# Altium project SAMSUNG_Note3_Monitor.PrjPcb
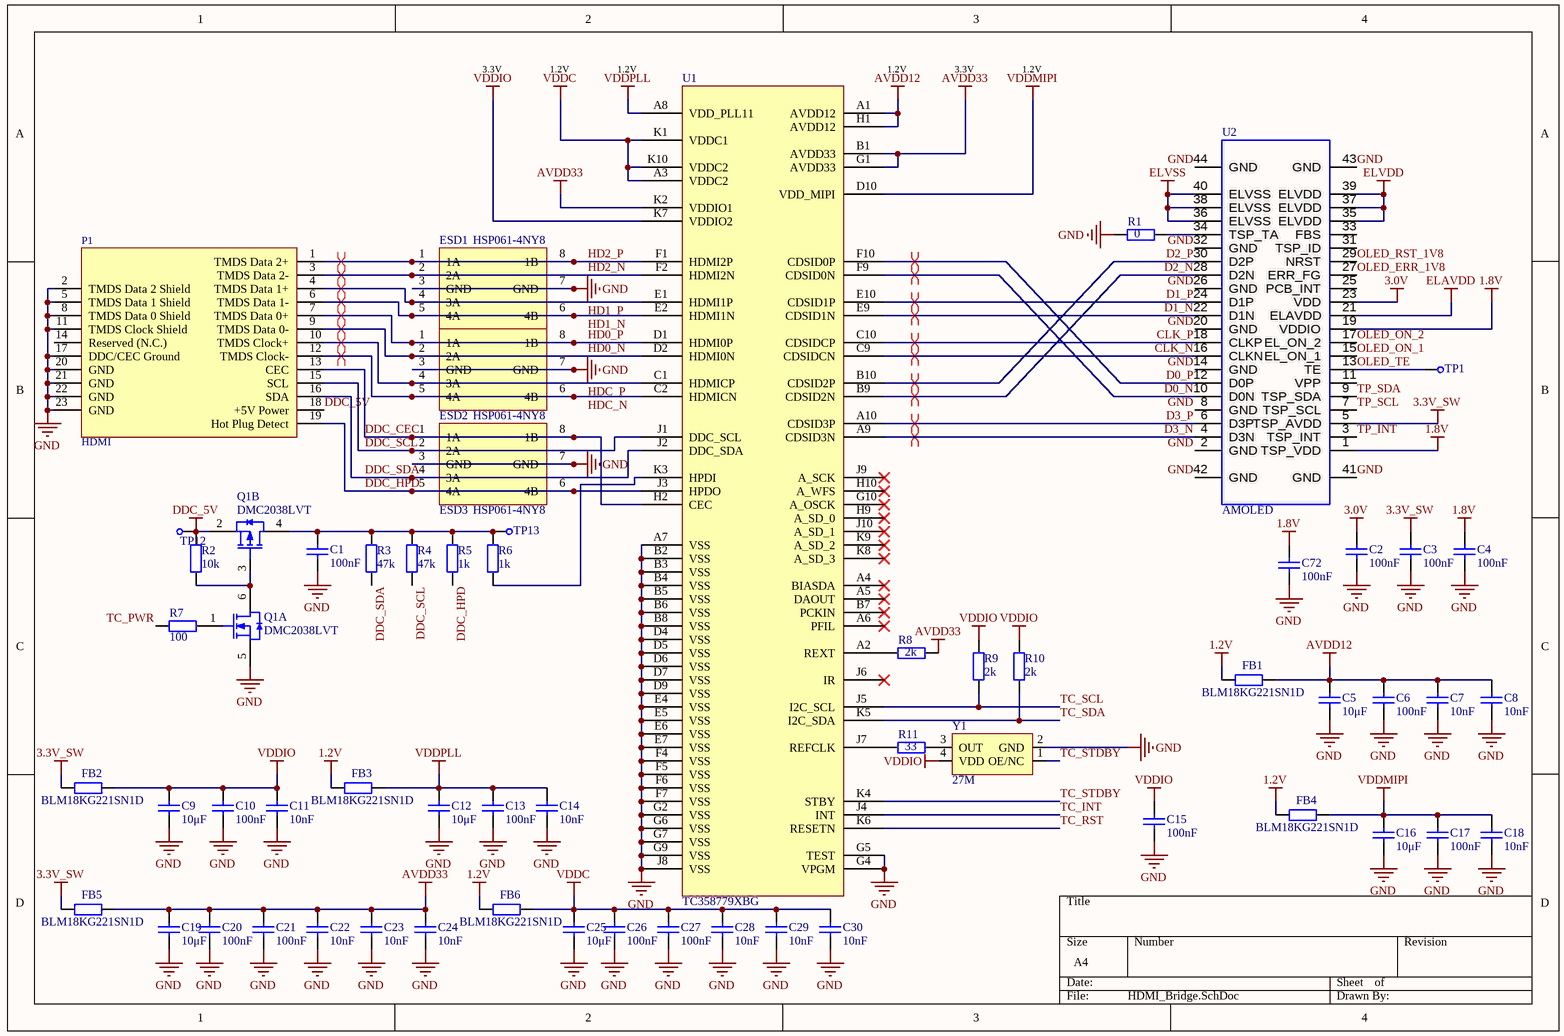
[diagram p0: HDMI_Bridge.SchDoc]
3 sheets, 163 parts. Net scope: global (net labels, ports and power ports of the same name join across sheets).
Board file: SAMSUNG_Note3_Monitor.PcbDoc
Sheets:
  HDMI_Bridge.SchDoc
  STM32.SchDoc
  Power.SchDoc

## Sheet HDMI_Bridge.SchDoc
size A4; SheetNumber: 1; SheetTotal: 3

### Parts
C1  value 100nF  [0402C]  (hidden comment: Cap)
C2  value 100nF  [0402C]  (hidden comment: Cap)
C3  value 100nF  [0402C]  (hidden comment: Cap)
C4  value 100nF  [0402C]  (hidden comment: Cap)
C5  value 10μF  [0603C]  (hidden comment: Cap)
C6  value 100nF  [0402C]  (hidden comment: Cap)
C7  value 10nF  [0402C]  (hidden comment: Cap)
C8  value 10nF  [0402C]  (hidden comment: Cap)
C9  value 10μF  [0603C]  (hidden comment: Cap)
C10  value 100nF  [0402C]  (hidden comment: Cap)
C11  value 10nF  [0402C]  (hidden comment: Cap)
C12  value 10μF  [0603C]  (hidden comment: Cap)
C13  value 100nF  [0402C]  (hidden comment: Cap)
C14  value 10nF  [0402C]  (hidden comment: Cap)
C15  value 100nF  [0402C]  (hidden comment: Cap)
C16  value 10μF  [0603C]  (hidden comment: Cap)
C17  value 100nF  [0402C]  (hidden comment: Cap)
C18  value 10nF  [0402C]  (hidden comment: Cap)
C19  value 10μF  [0603C]  (hidden comment: Cap)
C20  value 100nF  [0402C]  (hidden comment: Cap)
C21  value 100nF  [0402C]  (hidden comment: Cap)
C22  value 10nF  [0402C]  (hidden comment: Cap)
C23  value 10nF  [0402C]  (hidden comment: Cap)
C24  value 10nF  [0402C]  (hidden comment: Cap)
C25  value 10μF  [0603C]  (hidden comment: Cap)
C26  value 100nF  [0402C]  (hidden comment: Cap)
C27  value 100nF  [0402C]  (hidden comment: Cap)
C28  value 10nF  [0402C]  (hidden comment: Cap)
C29  value 10nF  [0402C]  (hidden comment: Cap)
C30  value 10nF  [0402C]  (hidden comment: Cap)
C72  value 100nF  [0402C]  (hidden comment: Cap)
ESD1  HSP061-4NY8  [HSP061-4NY8]
ESD2  HSP061-4NY8  [HSP061-4NY8]
ESD3  HSP061-4NY8  [HSP061-4NY8]
FB1  value BLM18KG221SN1D  [0603R]  (hidden comment: Resistor)
FB2  value BLM18KG221SN1D  [0603R]  (hidden comment: Resistor)
FB3  value BLM18KG221SN1D  [0603R]  (hidden comment: Resistor)
FB4  value BLM18KG221SN1D  [0603R]  (hidden comment: Resistor)
FB5  value BLM18KG221SN1D  [0603R]  (hidden comment: Resistor)
FB6  value BLM18KG221SN1D  [0603R]  (hidden comment: Resistor)
P1  HDMI  [HDMI-SMD_HDMI-001S]
Q1  DMC2038LVT  [SOT-23-6]  (parts A,B of 2)
R1  value 0  [0402R]  (hidden comment: Resistor)
R2  value 10k  [0402R]  (hidden comment: Resistor)
R3  value 47k  [0402R]  (hidden comment: Resistor)
R4  value 47k  [0402R]  (hidden comment: Resistor)
R5  value 1k  [0402R]  (hidden comment: Resistor)
R6  value 1k  [0402R]  (hidden comment: Resistor)
R7  value 100  [0402R]  (hidden comment: Resistor)
R8  value 2k  [0402R]  (hidden comment: Resistor)
R9  value 2k  [0402R]  (hidden comment: Resistor)
R10  value 2k  [0402R]  (hidden comment: Resistor)
R11  value 33  [0402R]  (hidden comment: Resistor)
TP1  CHECK  [CHECK-B]  (value not drawn)
TP12  CHECK  [CHECK-B]  (value not drawn)
TP13  CHECK  [CHECK-B]  (value not drawn)
U1  TC358779XBG  [BGA-80_L7.0-W7.0-R10-C10-P0.65-TL]
U2  AMOLED  [BTB_AXE440124]
Y1  value 27M  [XTAL-3225-4P]  (hidden comment: XATLS)

### Nets
1.2V: FB1.1 FB3.1 FB4.1 FB6.1
1.8V: C4.2 C72.2 U2.1(TSP_VDD) U2.19(VDDIO)
3.0V: C2.2 U2.23(VDD)
3.3V_SW: C3.2 FB2.1 FB5.1 U2.5(TSP_AVDD)
AVDD12: C5.2 C6.2 C7.2 C8.2 FB1.2 U1.A1(AVDD12) U1.H1(AVDD12)
AVDD33: C19.2 C20.2 C21.2 C22.2 C23.2 C24.2 FB5.2 R8.1 U1.B1(AVDD33) U1.G1(AVDD33) U1.K2(VDDIO1)
DDC_5V: P1.18(+5V_Power) Q1.2(S) R2.1 TP12.1
ELAVDD: U2.21(ELAVDD)
ELVDD: U2.35(ELVDD) U2.37(ELVDD) U2.39(ELVDD)
ELVSS: U2.36(ELVSS) U2.38(ELVSS) U2.40(ELVSS)
GND: C1.1 C2.1 C3.1 C4.1 C5.1 C6.1 C7.1 C8.1 C9.1 C10.1 C11.1 C12.1 C13.1 C14.1 C15.1 C16.1 C17.1 C18.1 C19.1 C20.1 C21.1 C22.1 C23.1 C24.1 C25.1 C26.1 C27.1 C28.1 C29.1 C30.1 C72.1 ESD1.3(GND) ESD1.7(GND) ESD2.3(GND) ESD2.7(GND) ESD3.3(GND) ESD3.7(GND) P1.2(TMDS_Data_2_Shield) P1.5(TMDS_Data_1_Shield) P1.8(TMDS_Data_0_Shield) P1.11(TMDS_Clock_Shield) P1.17(DDC/CEC_Ground) P1.20(GND) P1.21(GND) P1.22(GND) P1.23(GND) Q1.5(S) R1.2 U1.A7(VSS) U1.B2(VSS) U1.B3(VSS) U1.B4(VSS) U1.B5(VSS) U1.B6(VSS) U1.B8(VSS) U1.D4(VSS) U1.D5(VSS) U1.D6(VSS) U1.D7(VSS) U1.D9(VSS) U1.E4(VSS) U1.E5(VSS) U1.E6(VSS) U1.E7(VSS) U1.F4(VSS) U1.F5(VSS) U1.F6(VSS) U1.F7(VSS) U1.G2(VSS) U1.G4(VPGM) U1.G5(TEST) U1.G6(VSS) U1.G7(VSS) U1.G9(VSS) U1.J8(VSS) U2.2(GND) U2.8(GND) U2.14(GND) U2.20(GND) U2.26(GND) U2.32(GND) U2.41(GND) U2.42(GND) U2.43(GND) U2.44(GND) Y1.2(GND)
VDDC: C25.2 C26.2 C27.2 C28.2 C29.2 C30.2 FB6.2 U1.A3(VDDC2) U1.K1(VDDC1) U1.K10(VDDC2)
VDDIO: C9.2 C10.2 C11.2 C15.2 FB2.2 R9.1 R10.1 U1.K7(VDDIO2) Y1.4(VDD)
VDDMIPI: C16.2 C17.2 C18.2 FB4.2 U1.D10(VDD_MIPI)
VDDPLL: C12.2 C13.2 C14.2 FB3.2 U1.A8(VDD_PLL11)
CLK_N: U1.C9(CDSIDCN) U2.16(CLKN)
CLK_P: U1.C10(CDSIDCP) U2.18(CLKP)
D0_N: U1.F9(CDSID0N) U2.10(D0N)
D0_P: U1.F10(CDSID0P) U2.12(D0P)
D1_N: U1.E9(CDSID1N) U2.22(D1N)
D1_P: U1.E10(CDSID1P) U2.24(D1P)
D2_N: U1.B9(CDSID2N) U2.28(D2N)
D2_P: U1.B10(CDSID2P) U2.30(D2P)
D3_N: U1.A9(CDSID3N) U2.4(D3N)
D3_P: U1.A10(CDSID3P) U2.6(D3P)
DDC_CEC: ESD3.1(1A) ESD3.8(1B) P1.13(CEC) U1.H2(CEC)
DDC_HPD: ESD3.5(4A) ESD3.6(4B) P1.19(Hot_Plug_Detect) R5.2 U1.J3(HPDO)
DDC_SCL: ESD3.2(2A) P1.15(SCL) R4.2 U1.J1(DDC_SCL)
DDC_SDA: ESD3.4(3A) P1.16(SDA) R3.2 U1.J2(DDC_SDA)
HD0_N: ESD2.2(2A) P1.9(TMDS_Data_0-) U1.D2(HDMI0N)
HD0_P: ESD2.1(1A) ESD2.8(1B) P1.7(TMDS_Data_0+) U1.D1(HDMI0P)
HD1_N: ESD1.5(4A) ESD1.6(4B) P1.6(TMDS_Data_1-) U1.E2(HDMI1N)
HD1_P: ESD1.4(3A) P1.4(TMDS_Data_1+) U1.E1(HDMI1P)
HD2_N: ESD1.2(2A) P1.3(TMDS_Data_2-) U1.F2(HDMI2N)
HD2_P: ESD1.1(1A) ESD1.8(1B) P1.1(TMDS_Data_2+) U1.F1(HDMI2P)
HDC_N: ESD2.5(4A) ESD2.6(4B) P1.12(TMDS_Clock-) U1.C2(HDMICN)
HDC_P: ESD2.4(3A) P1.10(TMDS_Clock+) U1.C1(HDMICP)
OLED_ERR_1V8: U2.27(ERR_FG)
OLED_ON_1: U2.15(EL_ON_1)
OLED_ON_2: U2.17(EL_ON_2)
OLED_RST_1V8: U2.29(NRST)
OLED_TE: TP1.1 U2.13(TE)
TC_INT: U1.J4(INT)
TC_PWR: R7.1
TC_RST: U1.K6(RESETN)
TC_SCL: R9.2 U1.J5(I2C_SCL)
TC_SDA: R10.2 U1.K5(I2C_SDA)
TC_STDBY: U1.K4(STBY) Y1.1(OE/NC)
TP_INT: U2.3(TSP_INT)
TP_SCL: U2.7(TSP_SCL)
TP_SDA: U2.9(TSP_SDA)
NetC1_2: C1.2 Q1.4(D) R3.1 R4.1 R5.1 R6.1 TP13.1
NetQ1_1: Q1.1(G) R7.2
NetQ1_3: Q1.3(G) Q1.6(D) R2.2
NetR1_1: R1.1 U2.34(TSP_TA)
NetR6_2: R6.2 U1.K3(HPDI)
NetR8_2: R8.2 U1.A2(REXT)
NetR11_1: R11.1 Y1.3(OUT)
NetR11_2: R11.2 U1.J7(REFCLK)

Not connected (* = marked no-connect by the designer): P1 14(Reserved_(N.C.)); U1 A4(BIASDA)* A5(DAOUT)* A6(PFIL)* B7(PCKIN)* G10(A_OSCK)* H9(A_SD_0)* H10(A_WFS)* J6(IR)* J9(A_SCK)* J10(A_SD_1)* K8(A_SD_3)* K9(A_SD_2)*; U2 11(VPP) 25(PCB_INT) 31(TSP_ID) 33(FBS)

### Layout directives
differential pair: CLK_N, CLK_P, D0_N, D0_P, D1_N, D1_P, D2_N, D2_P, D3_N, D3_P, HD0_N, HD0_P, HD1_N, HD1_P, HD2_N, HD2_P, HDC_N, HDC_P

### Notes on the sheet
- 3.3V
- 1.2V

### Library data of the parts
C1-C30 C72 = Cap: 无极性电容; Published: 8-Jun-2000; LatestRevisionDate: 17-Jul-2002; LatestRevisionNote: Re-released for DXP Platform.; PackageReference: RAD-0.3; Publisher: Altium Limited
ESD1-ESD3 = HSP061-4NY8: IC, 4-LINE ESD PROTECTION ARRAY, HIGH SPEED; Manufacturer: STMICROELECTRONICS; Part Number: HSP061-4NY8; Verified Pinout: *
FB1-FB6 R1-R11 = Resistor: 电阻; Published: 8-Jun-2000; LatestRevisionDate: 17-Jul-2002; LatestRevisionNote: Re-released for DXP Platform.; PackageReference: AXIAL-0.4; Publisher: Altium Limited
P1 = HDMI-Slot: HDMI Slot; BOM_Manufacturer: XUNPU(讯普); BOM_Manufacturer Part: HDMI-001S; Contributor: LCSC; BOM_Supplier: LCSC; BOM_Supplier Part: C720616; BOM_JLCPCB Part Class: Extended Part; spicePre: U; spiceSymbolName: HDMI-001S
Q1 = DMC2038LVT: Dual P + N MOS
TP1 TP12 TP13 = CHECK: 测试点
U1 = TC358779XBG: IC, HDMI RX TO MIPI DSI TX BRIDGE; Manufacturer: TOSHIBA; Part Number: TC358779XBG; Verified Pinout: *
U2 = OLED_AMS568: SAMSUNG AMOLED, CONNECTOR AXE440124, 40-PIN HEADER, 0.4MM PITCH; Manufacturer: PANASONIC; Part Number: AXE440124; Verified Pinout: *
Y1 = XATL-OSC: 贴片有源晶振

## Sheet STM32.SchDoc
size A4; SheetNumber: 2; SheetTotal: 3
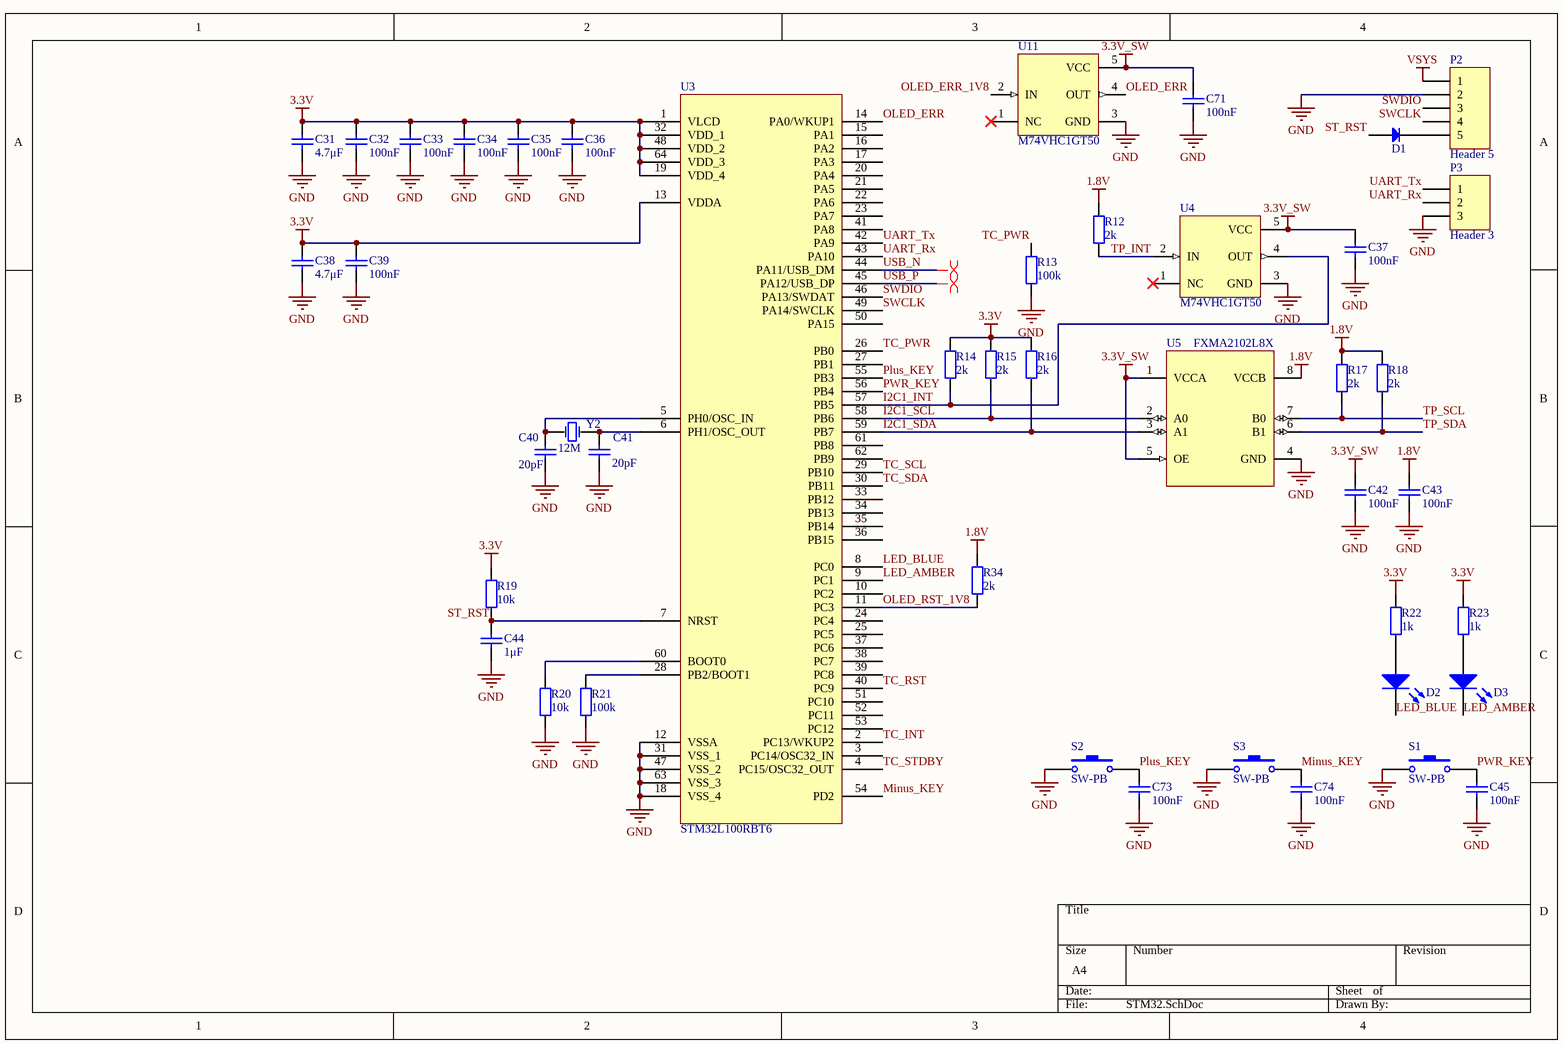
[diagram p1: STM32.SchDoc]

### Parts
C31  value 4.7μF  [0402C]  (hidden comment: Cap)
C32  value 100nF  [0402C]  (hidden comment: Cap)
C33  value 100nF  [0402C]  (hidden comment: Cap)
C34  value 100nF  [0402C]  (hidden comment: Cap)
C35  value 100nF  [0402C]  (hidden comment: Cap)
C36  value 100nF  [0402C]  (hidden comment: Cap)
C37  value 100nF  [0402C]  (hidden comment: Cap)
C38  value 4.7μF  [0402C]  (hidden comment: Cap)
C39  value 100nF  [0402C]  (hidden comment: Cap)
C40  value 20pF  [0402C]  (hidden comment: Cap)
C41  value 20pF  [0402C]  (hidden comment: Cap)
C42  value 100nF  [0402C]  (hidden comment: Cap)
C43  value 100nF  [0402C]  (hidden comment: Cap)
C44  value 1μF  [0402C]  (hidden comment: Cap)
C45  value 100nF  [0402C]  (hidden comment: Cap)
C71  value 100nF  [0402C]  (hidden comment: Cap)
C73  value 100nF  [0402C]  (hidden comment: Cap)
C74  value 100nF  [0402C]  (hidden comment: Cap)
D1  Diode  [SOD-323]  (value not drawn)
D2  LED0  [0603LED]  (value not drawn)
D3  LED0  [0603LED]  (value not drawn)
P2  Header 5  [HDR1X5]
P3  Header 3  [HDR1X3]
R12  value 2k  [0402R]  (hidden comment: Resistor)
R13  value 100k  [0402R]  (hidden comment: Resistor)
R14  value 2k  [0402R]  (hidden comment: Resistor)
R15  value 2k  [0402R]  (hidden comment: Resistor)
R16  value 2k  [0402R]  (hidden comment: Resistor)
R17  value 2k  [0402R]  (hidden comment: Resistor)
R18  value 2k  [0402R]  (hidden comment: Resistor)
R19  value 10k  [0402R]  (hidden comment: Resistor)
R20  value 10k  [0402R]  (hidden comment: Resistor)
R21  value 100k  [0402R]  (hidden comment: Resistor)
R22  value 1k  [0402R]  (hidden comment: Resistor)
R23  value 1k  [0402R]  (hidden comment: Resistor)
R34  value 2k  [0402R]  (hidden comment: Resistor)
S1  SW-PB  [SW-TS-TL3330E]
S2  SW-PB  [SW-TS-TL3330E]
S3  SW-PB  [SW-TS-TL3330E]
U3  STM32L100RBT6  [LQFP-64]
U4  M74VHC1GT50  [SC-70(SC-70-5)]
U5  FXMA2102L8X  [QFN-8_L1.6_W1.6]
U11  M74VHC1GT50  [SC-70(SC-70-5)]
Y2  value 12M  [XTAL_HC-49USX]  (hidden comment: XTAL)

### Nets
1.8V: C43.2 R12.1 R17.1 R18.1 R34.1 U5.8(VCCB)
3.3V: C31.2 C32.2 C33.2 C34.2 C35.2 C36.2 C38.2 C39.2 R14.1 R15.1 R16.1 R19.1 R22.1 R23.1 U3.1(VLCD) U3.13(VDDA) U3.19(VDD_4) U3.32(VDD_1) U3.48(VDD_2) U3.64(VDD_3)
3.3V_SW: C37.2 C42.2 C71.2 U4.5(VCC) U5.1(VCCA) U5.5(OE) U11.5(VCC)
GND: C31.1 C32.1 C33.1 C34.1 C35.1 C36.1 C37.1 C38.1 C39.1 C40.1 C41.1 C42.1 C43.1 C44.1 C45.1 C71.1 C73.1 C74.1 P2.2 P3.3 R13.2 R20.2 R21.2 S1.1 S2.1 S3.1 U3.12(VSSA) U3.18(VSS_4) U3.31(VSS_1) U3.47(VSS_2) U3.63(VSS_3) U4.3(GND) U5.4(GND) U11.3(GND)
VSYS: P2.1
I2C1_INT: R14.2 U3.57(PB5) U4.4(OUT)
I2C1_SCL: R15.2 U3.58(PB6) U5.2(A0)
I2C1_SDA: R16.2 U3.59(PB7) U5.3(A1)
LED_AMBER: D3.2(K) U3.9(PC1)
LED_BLUE: D2.2(K) U3.8(PC0)
Minus_KEY: C74.2 S3.2 U3.54(PD2)
OLED_ERR: U3.14(PA0/WKUP1) U11.4(OUT)
OLED_ERR_1V8: U11.2(IN)
OLED_RST_1V8: R34.2 U3.11(PC3)
Plus_KEY: C73.2 S2.2 U3.55(PB3)
PWR_KEY: C45.2 S1.2 U3.56(PB4)
ST_RST: C44.2 D1.1(A) R19.2 U3.7(NRST)
SWCLK: P2.4 U3.49(PA14/SWCLK)
SWDIO: P2.3 U3.46(PA13/SWDAT)
TC_INT: U3.2(PC13/WKUP2)
TC_PWR: R13.1 U3.26(PB0)
TC_RST: U3.40(PC9)
TC_SCL: U3.29(PB10)
TC_SDA: U3.30(PB11)
TC_STDBY: U3.4(PC15/OSC32_OUT)
TP_INT: R12.2 U4.2(IN)
TP_SCL: R17.2 U5.7(B0)
TP_SDA: R18.2 U5.6(B1)
UART_Rx: P3.2 U3.43(PA10)
UART_Tx: P3.1 U3.42(PA9)
USB_N: U3.44(PA11/USB_DM)
USB_P: U3.45(PA12/USB_DP)
NetC40_2: C40.2 U3.5(PH0/OSC_IN) Y2.2(OSC2)
NetC41_2: C41.2 U3.6(PH1/OSC_OUT) Y2.1(OSC1)
NetD1_2: D1.2(K) P2.5
NetD2_1: D2.1(A) R22.2
NetD3_1: D3.1(A) R23.2
NetR20_1: R20.1 U3.60(BOOT0)
NetR21_1: R21.1 U3.28(PB2/BOOT1)

Not connected (* = marked no-connect by the designer): U3 3(PC14/OSC32_IN) 10(PC2) 15(PA1) 16(PA2) 17(PA3) 20(PA4) 21(PA5) 22(PA6) 23(PA7) 24(PC4) 25(PC5) 27(PB1) 33(PB12) 34(PB13) 35(PB14) 36(PB15) 37(PC6) 38(PC7) 39(PC8) 41(PA8) 50(PA15) 51(PC10) 52(PC11) 53(PC12) 61(PB8) 62(PB9); U4 1(NC)*; U11 1(NC)*

### Layout directives
differential pair: USB_N, USB_P

### Library data of the parts
C31-C45 C71 C73 C74 = Cap: 无极性电容; Published: 8-Jun-2000; LatestRevisionDate: 17-Jul-2002; LatestRevisionNote: Re-released for DXP Platform.; PackageReference: RAD-0.3; Publisher: Altium Limited
D1 = Diode: 二极管; Type: 1N4001; Published: 8-Jun-2000; LatestRevisionDate: 17-Jul-2002; LatestRevisionNote: Re-released for DXP Platform.; PackageDocument: Sep-1996; PackageReference: SMC; Publisher: Altium Limited; Code_JEDEC: DO-214-AB
D2 D3 = LED0: 发光二极管; Published: 8-Jun-2000; LatestRevisionDate: 08-Jul-2005; LatestRevisionNote: Mech Layer 1 removed.; PackageReference: LED-0; Publisher: Altium Limited
P2 = Header 5: Header, 5-Pin; LatestRevisionDate: 17-Jul-2002; LatestRevisionNote: Re-released for DXP Platform.; Publisher: Altium Limited
P3 = Header 3: Header, 3-Pin; LatestRevisionDate: 17-Jul-2002; LatestRevisionNote: Re-released for DXP Platform.; Publisher: Altium Limited
R12-R23 R34 = Resistor: 电阻; Published: 8-Jun-2000; LatestRevisionDate: 17-Jul-2002; LatestRevisionNote: Re-released for DXP Platform.; PackageReference: AXIAL-0.4; Publisher: Altium Limited
S1-S3 = SW-PB: 微动开关; Published: 24-Mar-1999; LatestRevisionDate: 17-Jul-2002; LatestRevisionNote: Re-released for DXP Platform.; PackageReference: SPST-2; Publisher: Altium Limited
U3 = STM32L100RBT6: IC, STM32L MICROCONTROLLER, ARM CORTEX M3; Manufacturer: ST MICROELECTRONICS; Part Number: STM32L100RBT6; Verified Pinout: *
U4 U11 = M74VHC1GT50DFT2G: IC, NON-INVERTING BUFFER, CMOS LOGIC LEVEL SHIFTER; Manufacturer: ON SEMICONDUCTOR; Part Number: M74VHC1GT50DFT2G; Pinout verified: *
U5 = FXMA2102L8X: IC, I2C TRANSLATOR, BUFFER AND REPEATER; Manufacturer: FAIRCHILD SEMICONDUCTOR; Part Number: FXMA2102L8X; Verified Pinout: *
Y2 = XTAL-2P: 晶振; Published: 8-Jun-2000; LatestRevisionDate: 17-Jul-2002; LatestRevisionNote: Re-released for DXP Platform.; PackageReference: R38; Publisher: Altium Limited

## Sheet Power.SchDoc
size A4; SheetNumber: 3; SheetTotal: 3
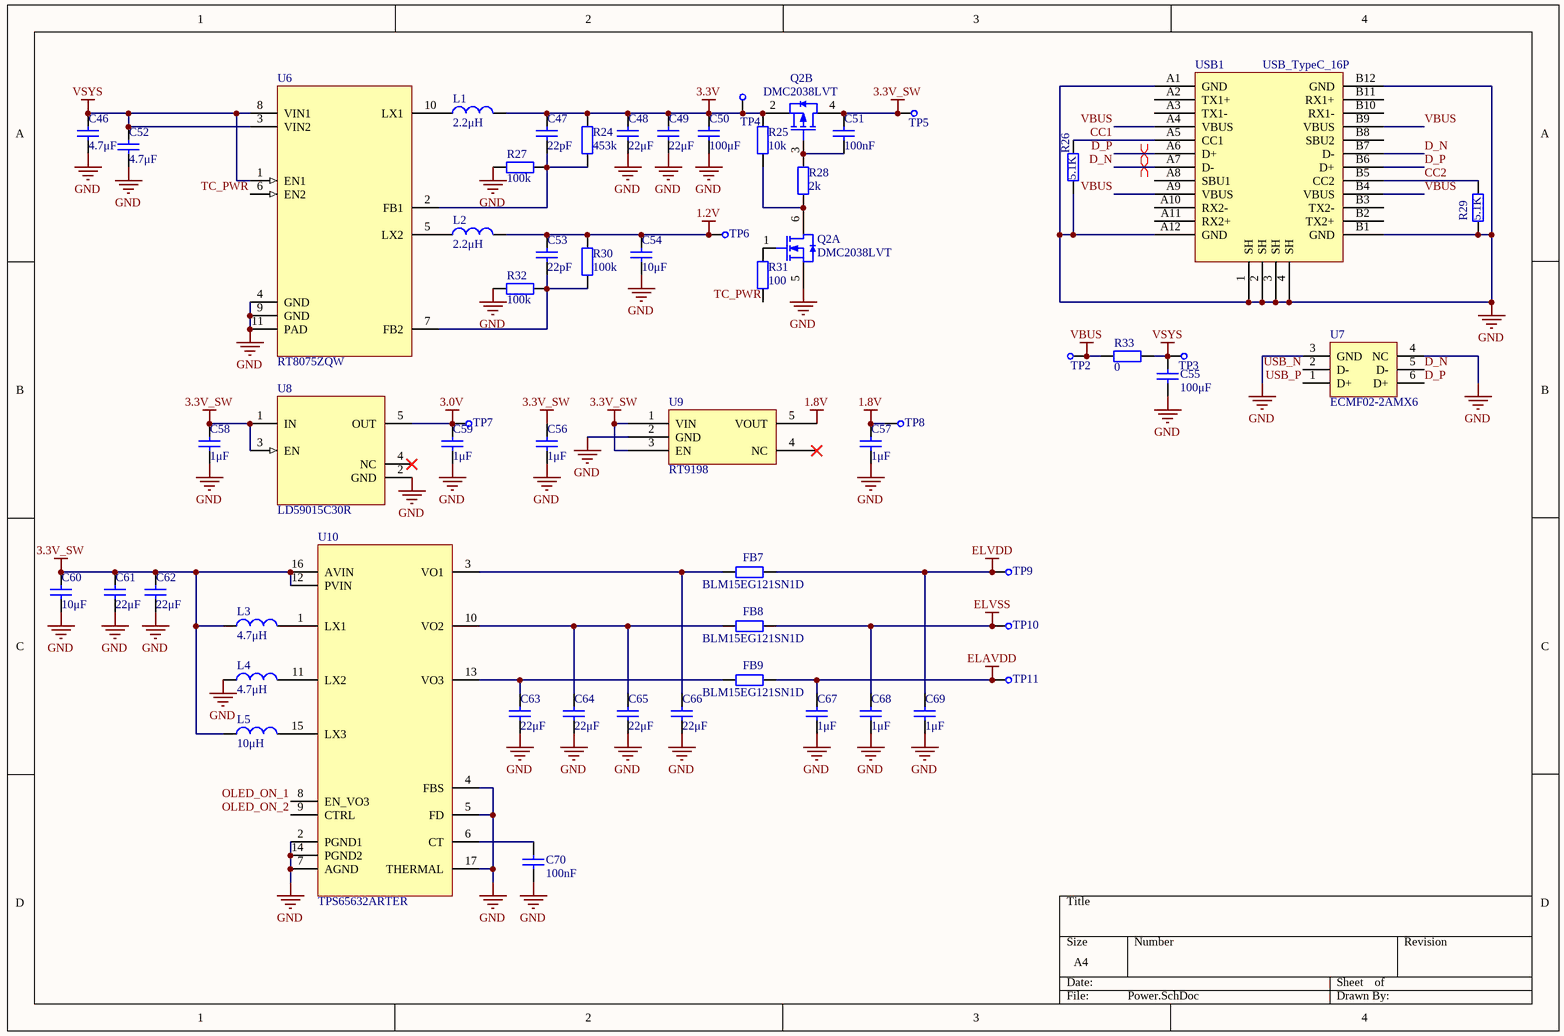
[diagram p2: Power.SchDoc]

### Parts
C46  value 4.7μF  [0402C]  (hidden comment: Cap)
C47  value 22pF  [0402C]  (hidden comment: Cap)
C48  value 22μF  [0805C]  (hidden comment: Cap)
C49  value 22μF  [0805C]  (hidden comment: Cap)
C50  value 100μF  [1206C]  (hidden comment: Cap)
C51  value 100nF  [0402C]  (hidden comment: Cap)
C52  value 4.7μF  [0402C]  (hidden comment: Cap)
C53  value 22pF  [0402C]  (hidden comment: Cap)
C54  value 10μF  [0603C]  (hidden comment: Cap)
C55  value 100μF  [1206C]  (hidden comment: Cap)
C56  value 1μF  [0402C]  (hidden comment: Cap)
C57  value 1μF  [0402C]  (hidden comment: Cap)
C58  value 1μF  [0402C]  (hidden comment: Cap)
C59  value 1μF  [0402C]  (hidden comment: Cap)
C60  value 10μF  [0603C]  (hidden comment: Cap)
C61  value 22μF  [0805C]  (hidden comment: Cap)
C62  value 22μF  [0805C]  (hidden comment: Cap)
C63  value 22μF  [0805C]  (hidden comment: Cap)
C64  value 22μF  [0805C]  (hidden comment: Cap)
C65  value 22μF  [0805C]  (hidden comment: Cap)
C66  value 22μF  [0805C]  (hidden comment: Cap)
C67  value 1μF  [0402C]  (hidden comment: Cap)
C68  value 1μF  [0402C]  (hidden comment: Cap)
C69  value 1μF  [0402C]  (hidden comment: Cap)
C70  value 100nF  [0402C]  (hidden comment: Cap)
FB7  value BLM15EG121SN1D  [0402R]  (hidden comment: Resistor)
FB8  value BLM15EG121SN1D  [0402R]  (hidden comment: Resistor)
FB9  value BLM15EG121SN1D  [0402R]  (hidden comment: Resistor)
L1  value 2.2μH  [IND-SMD_L3.0-W3.0_FNR30XXS]  (hidden comment: Inductor)
L2  value 2.2μH  [IND-SMD_L3.0-W3.0_FNR30XXS]  (hidden comment: Inductor)
L3  value 4.7μH  [IND-SMD_L2.5-W2.0-1]  (hidden comment: Inductor)
L4  value 4.7μH  [IND-SMD_L2.5-W2.0-1]  (hidden comment: Inductor)
L5  value 10μH  [IND-SMD_L3.0-W3.0_FNR30XXS]  (hidden comment: Inductor)
Q2  DMC2038LVT  [SOT-23-6]  (parts A,B of 2)
R24  value 453k  [0402R]  (hidden comment: Resistor)
R25  value 10k  [0402R]  (hidden comment: Resistor)
R26  value 5.1K  [0402R]  (hidden comment: Resistor)
R27  value 100k  [0402R]  (hidden comment: Resistor)
R28  value 2k  [0402R]  (hidden comment: Resistor)
R29  value 5.1K  [0402R]  (hidden comment: Resistor)
R30  value 100k  [0402R]  (hidden comment: Resistor)
R31  value 100  [0402R]  (hidden comment: Resistor)
R32  value 100k  [0402R]  (hidden comment: Resistor)
R33  value 0  [0805R]  (hidden comment: Resistor)
TP2  CHECK  [CHECK-B]  (value not drawn)
TP3  CHECK  [CHECK-B]  (value not drawn)
TP4  CHECK  [CHECK-B]  (value not drawn)
TP5  CHECK  [CHECK-B]  (value not drawn)
TP6  CHECK  [CHECK-B]  (value not drawn)
TP7  CHECK  [CHECK-B]  (value not drawn)
TP8  CHECK  [CHECK-B]  (value not drawn)
TP9  CHECK  [CHECK-B]  (value not drawn)
TP10  CHECK  [CHECK-B]  (value not drawn)
TP11  CHECK  [CHECK-B]  (value not drawn)
U6  RT8075ZQW  [DFN-10_L3.0_W3.0_P0.5]
U7  ECMF02-2AMX6  [DFN-6_L1.5_W1.7_P0.5]
U8  LD59015C30R  [SC-70(SC-70-5)]
U9  RT9198  [SOT-23-5]
U10  TPS65632ARTER  [QFN-16_L3.0_W3.0]
USB1  USB_TypeC_16P  [USB3.0-TYPE-C-SMD_16PIN-H-PITCH0.50]

### Nets
1.2V: C53.2 C54.2 L2.2 R30.2 TP6.1
1.8V: C57.2 TP8.1 U9.5(VOUT)
3.0V: C59.2 TP7.1 U8.5(OUT)
3.3V: C47.2 C48.2 C49.2 C50.2 L1.2 Q2.2(S) R24.2 R25.1 TP4.1
3.3V_SW: C51.2 C56.2 C58.2 C60.2 C61.2 C62.2 L3.1 L5.1 Q2.4(D) TP5.1 U8.1(IN) U8.3(EN) U9.1(VIN) U9.3(EN) U10.12(PVIN) U10.16(AVIN)
ELAVDD: C67.2 FB9.2 TP11.1
ELVDD: C69.2 FB7.2 TP9.1
ELVSS: C68.2 FB8.2 TP10.1
GND: C46.1 C48.1 C49.1 C50.1 C52.1 C54.1 C55.1 C56.1 C57.1 C58.1 C59.1 C60.1 C61.1 C62.1 C63.1 C64.1 C65.1 C66.1 C67.1 C68.1 C69.1 C70.1 L4.1 Q2.5(S) R26.1 R27.2 R29.1 R32.2 U6.4(GND) U6.9(GND) U6.11(PAD) U7.3(GND) U7.4(NC) U8.2(GND) U9.2(GND) U10.2(PGND1) U10.4(FBS) U10.5(FD) U10.7(AGND) U10.14(PGND2) U10.17(THERMAL) USB1.1(SH) USB1.2(SH) USB1.3(SH) USB1.4(SH) USB1.A1(GND) USB1.A12(GND) USB1.B1(GND) USB1.B12(GND)
VBUS: R33.1 TP2.1 USB1.A4(VBUS) USB1.A9(VBUS) USB1.B4(VBUS) USB1.B9(VBUS)
VSYS: C46.2 C52.2 C55.2 R33.2 TP3.1 U6.1(EN1) U6.3(VIN2) U6.8(VIN1)
CC1: R26.2 USB1.A5(CC1)
CC2: R29.2 USB1.B5(CC2)
D_N: U7.5(D-) USB1.A7(D-) USB1.B7(D-)
D_P: U7.6(D+) USB1.A6(D+) USB1.B6(D+)
OLED_ON_1: U10.8(EN_VO3)
OLED_ON_2: U10.9(CTRL)
TC_PWR: R31.2 U6.6(EN2)
USB_N: U7.2(D-)
USB_P: U7.1(D+)
NetC47_1: C47.1 R24.1 R27.1 U6.2(FB1)
NetC51_1: C51.1 Q2.3(G) R28.1
NetC53_1: C53.1 R30.1 R32.1 U6.7(FB2)
NetC63_2: C63.2 FB9.1 U10.13(VO3)
NetC64_2: C64.2 C65.2 FB8.1 U10.10(VO2)
NetC66_2: C66.2 FB7.1 U10.3(VO1)
NetC70_2: C70.2 U10.6(CT)
NetL1_1: L1.1 U6.10(LX1)
NetL2_1: L2.1 U6.5(LX2)
NetL3_2: L3.2 U10.1(LX1)
NetL4_2: L4.2 U10.11(LX2)
NetL5_2: L5.2 U10.15(LX3)
NetQ2_1: Q2.1(G) R31.1
NetQ2_6: Q2.6(D) R25.2 R28.2

Not connected (* = marked no-connect by the designer): U8 4(NC)*; U9 4(NC)*; USB1 A2(TX1+) A3(TX1-) A8(SBU1) A10(RX2-) A11(RX2+) B2(TX2+) B3(TX2-) B8(SBU2) B10(RX1-) B11(RX1+)

### Layout directives
differential pair: D_N, D_P

### Library data of the parts
C46-C70 = Cap: 无极性电容; Published: 8-Jun-2000; LatestRevisionDate: 17-Jul-2002; LatestRevisionNote: Re-released for DXP Platform.; PackageReference: RAD-0.3; Publisher: Altium Limited
FB7-FB9 R24-R33 = Resistor: 电阻; Published: 8-Jun-2000; LatestRevisionDate: 17-Jul-2002; LatestRevisionNote: Re-released for DXP Platform.; PackageReference: AXIAL-0.4; Publisher: Altium Limited
L1-L5 = Inductor: 电感; Code_IEC: 1005; Published: 8-Jun-2000; LatestRevisionDate: 17-Jul-2002; LatestRevisionNote: Re-released for DXP Platform.; PackageReference: 0402-A; Publisher: Altium Limited; Code_JEITA: 0402
Q2 = DMC2038LVT: Dual P + N MOS
TP2-TP11 = CHECK: 测试点
U6 = RT8075ZQW: IC, DUAL STEP DOWN CONVERTER, 1A, 1.25MHz; Manufacturer: RICHTEK; Part Number: RT8075ZQW; Pinout verified: *
U7 = ECMF02-2AMX6: IC, COMMON MODE FILTER WITH ESD PROTECTION FOR MIPI; Manufacturer: STMICROELECTRONICS; Part Number: ECMF02-2AMX6; Verified Pinout: *
U8 = LD59015C30R: IC, LDO REGULATOR, 3.0V, 150mA, HIGH PSRR; Manufacturer: STMICROELECTRONICS; Part Number: LD59015C30R; Pinout verified: *
U9 = RT9198: LDO
U10 = TPS65632ARTER: IC, TRIPLE OUTPUT AMOLED DISPLAY POWER SUPPLY; Manufacturer: TEXAS INSTRUMENTS; Part Number: TPS65632ARTER
USB1 = USB_TypeC: TypeC Connector; pin to pad: A1>A1B12 A2>none A3>none A4>A4B9 A9>A9B4 A10>none A11>none A12>A12B1 B1>A12B1 B2>none B3>none B4>A9B4 B9>A4B9 B10>none B11>none B12>A1B12

## Nets that join several sheets
1.2V: HDMI_Bridge (FB1.1 FB3.1 FB4.1 FB6.1), Power (5 pins)
1.8V: HDMI_Bridge (C4.2 C72.2 U2.1 U2.19), STM32 (6 pins), Power (C57.2 TP8.1 U9.5)
3.0V: HDMI_Bridge (C2.2 U2.23), Power (C59.2 TP7.1 U8.5)
3.3V: STM32 (20 pins), Power (9 pins)
3.3V_SW: HDMI_Bridge (C3.2 FB2.1 FB5.1 U2.5), STM32 (7 pins), Power (16 pins)
ELAVDD: HDMI_Bridge (U2.21), Power (C67.2 FB9.2 TP11.1)
ELVDD: HDMI_Bridge (U2.35 U2.37 U2.39), Power (C69.2 FB7.2 TP9.1)
ELVSS: HDMI_Bridge (U2.36 U2.38 U2.40), Power (C68.2 FB8.2 TP10.1)
GND: HDMI_Bridge (86 pins), STM32 (34 pins), Power (49 pins)
VSYS: STM32 (P2.1), Power (8 pins)
OLED_ERR_1V8: HDMI_Bridge (U2.27), STM32 (U11.2)
OLED_ON_1: HDMI_Bridge (U2.15), Power (U10.8)
OLED_ON_2: HDMI_Bridge (U2.17), Power (U10.9)
OLED_RST_1V8: HDMI_Bridge (U2.29), STM32 (R34.2 U3.11)
TC_INT: HDMI_Bridge (U1.J4), STM32 (U3.2)
TC_PWR: HDMI_Bridge (R7.1), STM32 (R13.1 U3.26), Power (R31.2 U6.6)
TC_RST: HDMI_Bridge (U1.K6), STM32 (U3.40)
TC_SCL: HDMI_Bridge (R9.2 U1.J5), STM32 (U3.29)
TC_SDA: HDMI_Bridge (R10.2 U1.K5), STM32 (U3.30)
TC_STDBY: HDMI_Bridge (U1.K4 Y1.1), STM32 (U3.4)
TP_INT: HDMI_Bridge (U2.3), STM32 (R12.2 U4.2)
TP_SCL: HDMI_Bridge (U2.7), STM32 (R17.2 U5.7)
TP_SDA: HDMI_Bridge (U2.9), STM32 (R18.2 U5.6)
USB_N: STM32 (U3.44), Power (U7.2)
USB_P: STM32 (U3.45), Power (U7.1)